# EAGLE design RQ2_mainboard (EAGLE 7.7.0)
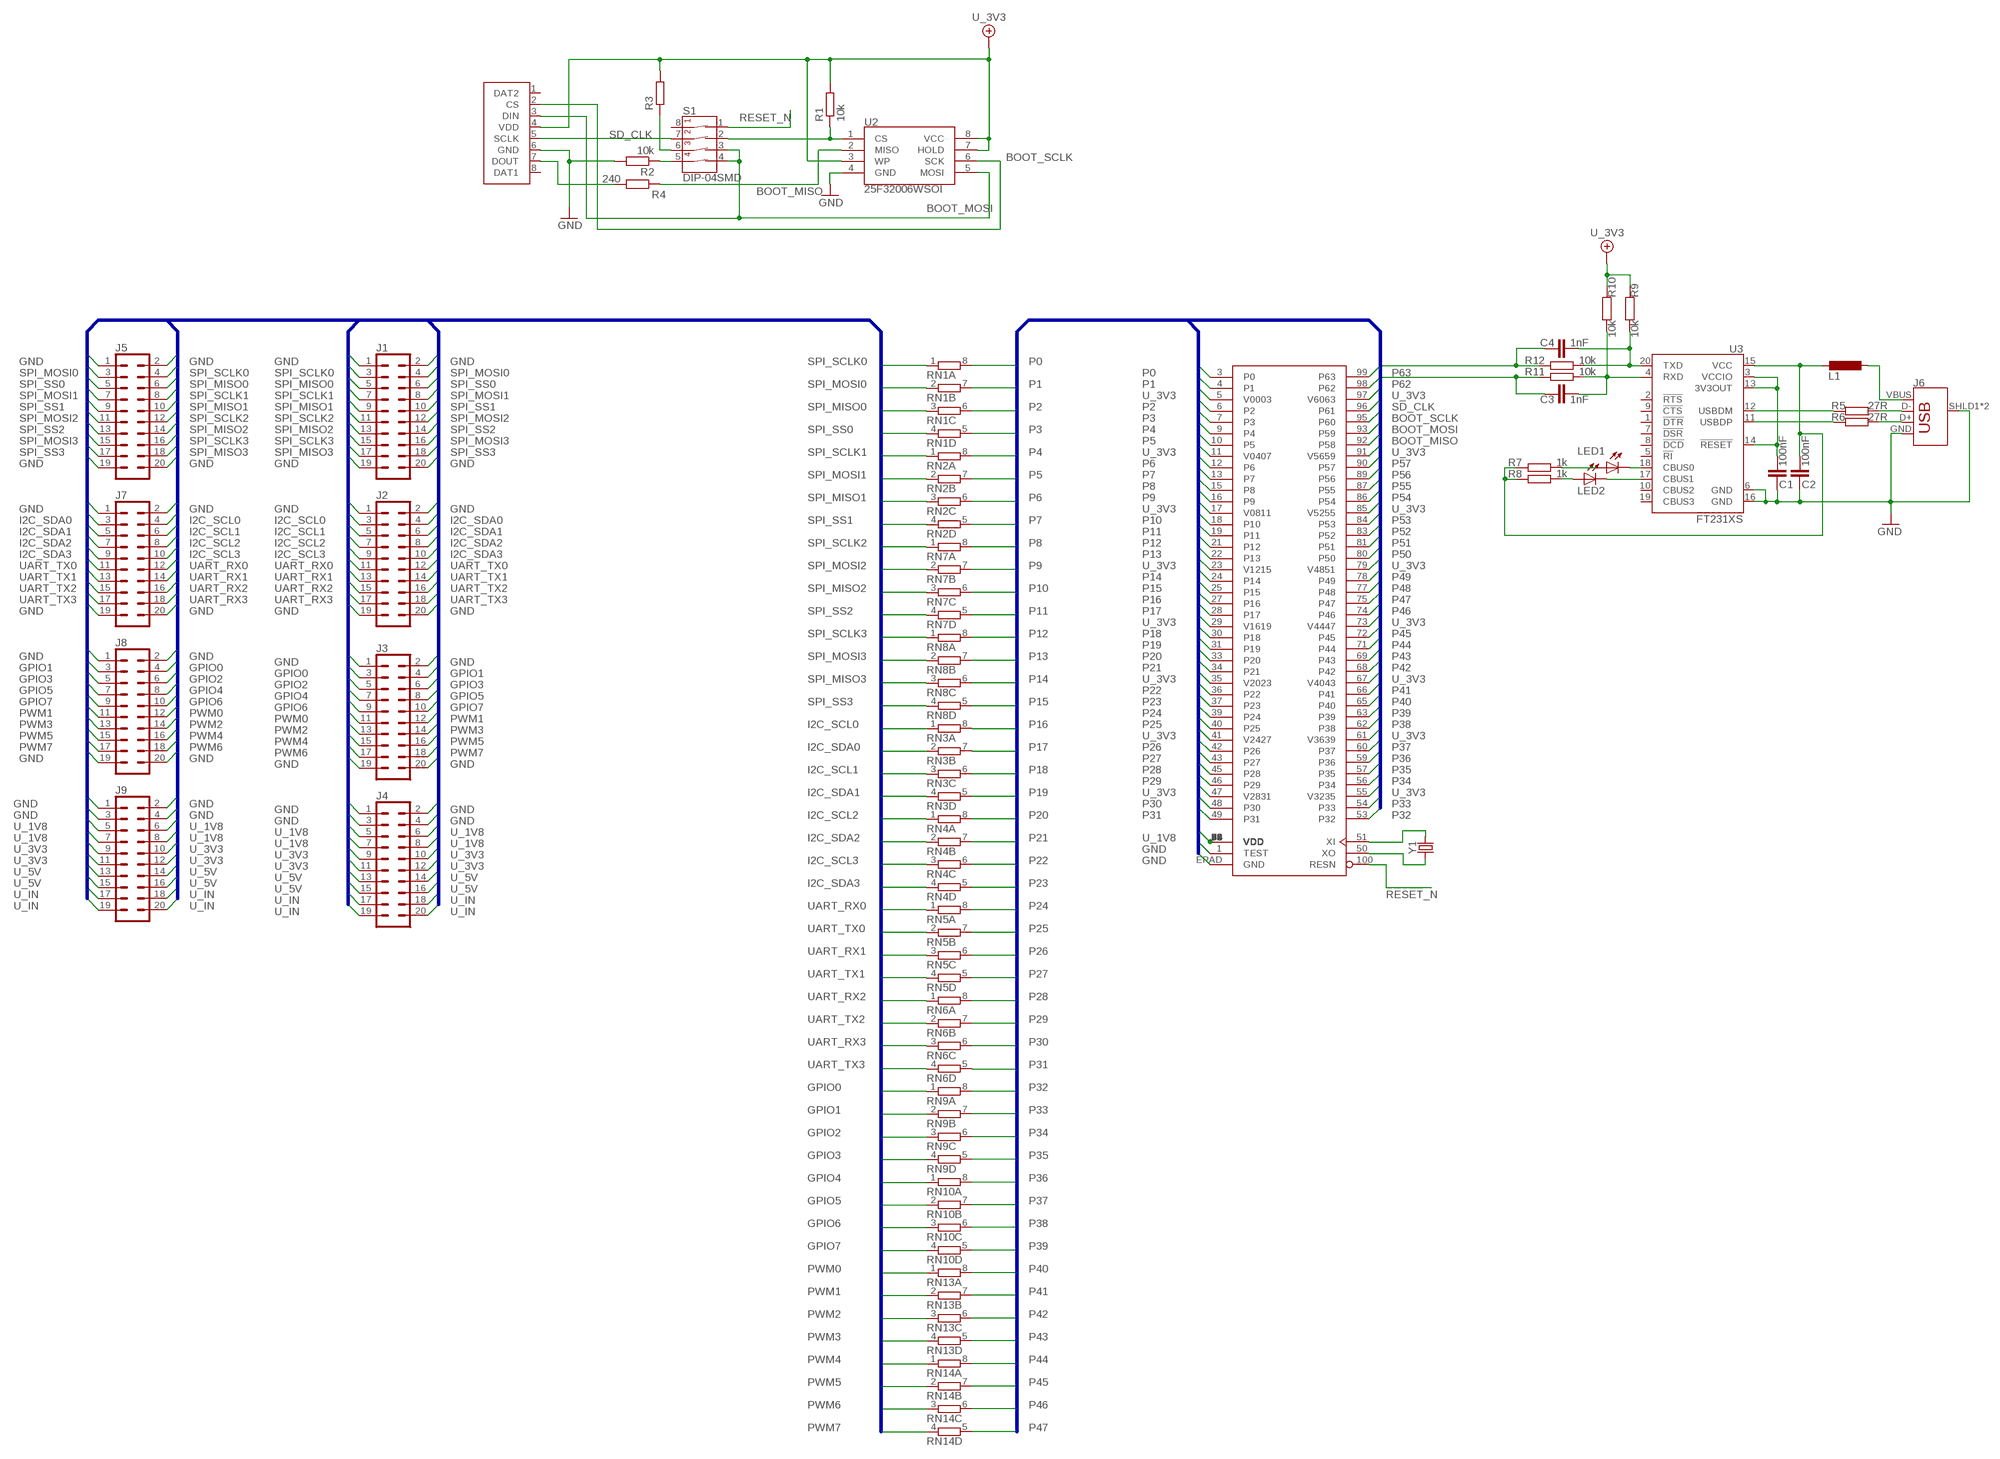
[diagram p0: schematic, sheet 1]

## Parts
C1  100nF  C-EUC0805  [C0805]
C2  100nF  C-EUC0805  [C0805]
C3  1nF  C-EUC0805  [C0805]
C4  1nF  C-EUC0805  [C0805]
J1  CONN_10X2SMT  [2X10_SMT]
J2  CONN_10X2SMT  [2X10_SMT]
J3  CONN_10X2SMT  [2X10_SMT]
J4  CONN_10X2SMT  [2X10_SMT]
J5  CONN_10X2SMT  [2X10_SMT]
J6  USB_B_PTH  [USB-B-PTH]
J7  CONN_10X2SMT  [2X10_SMT]
J8  CONN_10X2SMT  [2X10_SMT]
J9  CONN_10X2SMT  [2X10_SMT]
L1  L-EUL2012C  [L2012C]
LED1  LEDSML0805  [SML0805]
LED2  LEDSML0805  [SML0805]
R1  10k  R-EU_R0603  [R0603]
R2  10k  R-EU_R0603  [R0603]
R3  R-EU_R0603  [R0603]
R4  240  R-EU_R0603  [R0603]
R5  27R  R-EU_R0603  [R0603]
R6  27R  R-EU_R0603  [R0603]
R7  1k  R-EU_R0603  [R0603]
R8  1k  R-EU_R0603  [R0603]
R9  10k  R-EU_R0603  [R0603]
R10  10k  R-EU_R0603  [R0603]
R11  10k  R-EU_R0603  [R0603]
R12  10k  R-EU_R0603  [R0603]
RN1  4R-N0603-ARV  [0603-ARV]
RN2  4R-N0603-ARV  [0603-ARV]
RN3  4R-N0603-ARV  [0603-ARV]
RN4  4R-N0603-ARV  [0603-ARV]
RN5  4R-N0603-ARV  [0603-ARV]
RN6  4R-N0603-ARV  [0603-ARV]
RN7  4R-N0603-ARV  [0603-ARV]
RN8  4R-N0603-ARV  [0603-ARV]
RN9  4R-N0603-ARV  [0603-ARV]
RN10  4R-N0603-ARV  [0603-ARV]
RN13  4R-N0603-ARV  [0603-ARV]
RN14  4R-N0603-ARV  [0603-ARV]
S1  DIP-04SMD  [DIPSWITCH-04-SMD]
U1  P2X8C4M64P  [TQFP100]
U2  25F32006WSOI  SPI_FLASH-X25XXSMD1  [SO08-EIAJ]
U3  FT231XS  [SSOP20_L]
U$2  MICRO_SD_CONNECTORMOLEX_HINGE  [MICRO_SD]
Y1  CRYSTALSMD-5X3.2-2PAD  [CRYSTAL-SMD-5X3.2-2PAD]

## Nets
BOOT_MISO: R4.1 U1.92(P58) U2.2(MISO)
BOOT_MOSI: S1.3(3A) S1.4(4A) U1.93(P59) U2.5(MOSI) U$2.3(DIN)
BOOT_SCLK: U1.95(P60) U2.6(SCK) U$2.2(CS)
CBUS0: LED1.C U3.18(CBUS0)
CBUS1: LED2.C U3.17(CBUS1)
D_M: J6.D- R5.2
D_P: J6.D+ R6.2
FLASH_CS: R1.1 S1.2(2A) U2.1(CS)
GND: C1.2 C2.2 J1.1 J1.2 J1.19 J1.20 J2.1 J2.2 J2.19 J2.20 J3.1 J3.2 J3.19 J3.20 J4.1 J4.2 J4.3 J4.4 J5.1 J5.2 J5.19 J5.20 J6.GND J6.SHLD1(SHIELD) J6.SHLD2(SHIELD) J7.1 J7.2 J7.19 J7.20 J8.1 J8.2 J8.19 J8.20 J9.1 J9.2 J9.3 J9.4 R2.2 U1.1(TEST) U1.EPAD(GND) U2.4(GND) U3.6(GND) U3.16(GND) U$2.6(GND)
GPIO0: J3.3 J8.4 RN9.1
GPIO1: J3.4 J8.3 RN9.2
GPIO2: J3.5 J8.6 RN9.3
GPIO3: J3.6 J8.5 RN9.4
GPIO4: J3.7 J8.8 RN10.1
GPIO5: J3.8 J8.7 RN10.2
GPIO6: J3.9 J8.10 RN10.3
GPIO7: J3.10 J8.9 RN10.4
I2C_SCL0: J2.3 J7.4 RN3.1
I2C_SCL1: J2.5 J7.6 RN3.3
I2C_SCL2: J2.7 J7.8 RN4.1
I2C_SCL3: J2.9 J7.10 RN4.3
I2C_SDA0: J2.4 J7.3 RN3.2
I2C_SDA1: J2.6 J7.5 RN3.4
I2C_SDA2: J2.8 J7.7 RN4.2
I2C_SDA3: J2.10 J7.9 RN4.4
LED1: LED1.A R7.2
LED2: LED2.A R8.2
N$7: R2.1 S1.5(4B)
N$8: R3.1 S1.6(3B)
N$10: R4.2 U$2.7(DOUT)
P0: RN1.8 U1.3(P0)
P1: RN1.7 U1.4(P1)
P2: RN1.6 U1.6(P2)
P3: RN1.5 U1.7(P3)
P4: RN2.8 U1.9(P4)
P5: RN2.7 U1.10(P5)
P6: RN2.6 U1.12(P6)
P7: RN2.5 U1.13(P7)
P8: RN7.8 U1.15(P8)
P9: RN7.7 U1.16(P9)
P10: RN7.6 U1.18(P10)
P11: RN7.5 U1.19(P11)
P12: RN8.8 U1.21(P12)
P13: RN8.7 U1.22(P13)
P14: RN8.6 U1.24(P14)
P15: RN8.5 U1.25(P15)
P16: RN3.8 U1.27(P16)
P17: RN3.7 U1.28(P17)
P18: RN3.6 U1.30(P18)
P19: RN3.5 U1.31(P19)
P20: RN4.8 U1.33(P20)
P21: RN4.7 U1.34(P21)
P22: RN4.6 U1.36(P22)
P23: RN4.5 U1.37(P23)
P24: RN5.8 U1.39(P24)
P25: RN5.7 U1.40(P25)
P26: RN5.6 U1.42(P26)
P27: RN5.5 U1.43(P27)
P28: RN6.8 U1.45(P28)
P29: RN6.7 U1.46(P29)
P30: RN6.6 U1.48(P30)
P31: RN6.5 U1.49(P31)
P32: RN9.8 U1.53(P32)
P33: RN9.7 U1.54(P33)
P34: RN9.6 U1.56(P34)
P35: RN9.5 U1.57(P35)
P36: RN10.8 U1.59(P36)
P37: RN10.7 U1.60(P37)
P38: RN10.6 U1.62(P38)
P39: RN10.5 U1.63(P39)
P40: RN13.8 U1.65(P40)
P41: RN13.7 U1.66(P41)
P42: RN13.6 U1.68(P42)
P43: RN13.5 U1.69(P43)
P44: RN14.8 U1.71(P44)
P45: RN14.7 U1.72(P45)
P46: RN14.6 U1.74(P46)
P47: RN14.5 U1.75(P47)
P48: U1.77(P48)
P49: U1.78(P49)
P50: U1.80(P50)
P51: U1.81(P51)
P52: U1.83(P52)
P53: U1.84(P53)
P54: U1.86(P54)
P55: U1.87(P55)
P56: U1.89(P56)
P57: U1.90(P57)
P62: C3.1 R11.1 U1.98(P62)
P63: C4.1 R12.1 U1.99(P63)
PWM0: J3.11 J8.12 RN13.1
PWM1: J3.12 J8.11 RN13.2
PWM2: J3.13 J8.14 RN13.3
PWM3: J3.14 J8.13 RN13.4
PWM4: J3.15 J8.16 RN14.1
PWM5: J3.16 J8.15 RN14.2
PWM6: J3.17 J8.18 RN14.3
PWM7: J3.18 J8.17 RN14.4
RESET_N: S1.1(1A) U1.100(RESN)
SD_CLK: S1.7(2B) U1.96(P61) U$2.5(SCLK)
SPI_MISO0: J1.5 J5.6 RN1.3
SPI_MISO1: J1.9 J5.10 RN2.3
SPI_MISO2: J1.13 J5.14 RN7.3
SPI_MISO3: J1.17 J5.18 RN8.3
SPI_MOSI0: J1.4 J5.3 RN1.2
SPI_MOSI1: J1.8 J5.7 RN2.2
SPI_MOSI2: J1.12 J5.11 RN7.2
SPI_MOSI3: J1.16 J5.15 RN8.2
SPI_SCLK0: J1.3 J5.4 RN1.1
SPI_SCLK1: J1.7 J5.8 RN2.1
SPI_SCLK2: J1.11 J5.12 RN7.1
SPI_SCLK3: J1.15 J5.16 RN8.1
SPI_SS0: J1.6 J5.5 RN1.4
SPI_SS1: J1.10 J5.9 RN2.4
SPI_SS2: J1.14 J5.13 RN7.4
SPI_SS3: J1.18 J5.17 RN8.4
U_1V8: J4.5 J4.6 J4.7 J4.8 J9.5 J9.6 J9.7 J9.8 U1.2(VDD) U1.8(VDD) U1.14(VDD) U1.20(VDD) U1.26(VDD) U1.32(VDD) U1.38(VDD) U1.44(VDD) U1.52(VDD) U1.58(VDD) U1.64(VDD) U1.70(VDD) U1.76(VDD) U1.82(VDD) U1.88(VDD) U1.94(VDD)
U_3V3: J4.9 J4.10 J4.11 J4.12 J9.9 J9.10 J9.11 J9.12 R1.2 R3.2 R9.1 R10.1 U1.5(V0003) U1.11(V0407) U1.17(V0811) U1.23(V1215) U1.29(V1619) U1.35(V2023) U1.41(V2427) U1.47(V2831) U1.55(V3235) U1.61(V3639) U1.67(V4043) U1.73(V4447) U1.79(V4851) U1.85(V5255) U1.91(V5659) U1.97(V6063) U2.3(WP) U2.7(HOLD) U2.8(VCC) U$2.4(VDD)
U_5V: J4.13 J4.14 J4.15 J4.16 J9.13 J9.14 J9.15 J9.16
U_IN: J4.17 J4.18 J4.19 J4.20 J9.17 J9.18 J9.19 J9.20
UART_RX0: J2.11 J7.12 RN5.1
UART_RX1: J2.13 J7.14 RN5.3
UART_RX2: J2.15 J7.16 RN6.1
UART_RX3: J2.17 J7.18 RN6.3
UART_TX0: J2.12 J7.11 RN5.2
UART_TX1: J2.14 J7.13 RN5.4
UART_TX2: J2.16 J7.15 RN6.2
UART_TX3: J2.18 J7.17 RN6.4
USB_3V3: C1.1 U3.3(VCCIO) U3.13(3V3OUT) U3.14(!RESET)
USB_5V: C2.1 L1.2 R7.1 R8.1 U3.15(VCC)
USB_RX: C3.2 R10.2 R11.2 U3.4(RXD)
USB_TX: C4.2 R9.2 R12.2 U3.20(TXD)
USBDM: R5.1 U3.12(USBDM)
USBDP: R6.1 U3.11(USBDP)
VBUS: J6.VBUS L1.1
XIN: U1.51(XI) Y1.P$2
XOUT: U1.50(XO) Y1.P$1
Unconnected: S1.8(1B) U3.1(!DTR) U3.2(!RTS) U3.5(!RI) U3.7(!DSR) U3.8(!DCD) U3.9(!CTS) U3.10(CBUS2) U3.19(CBUS3) U$2.1(DAT2) U$2.8(DAT1)

## Buses
P[0..63],SPI_SCLK[0..3],SPI_MOSI[0..3],SPI_MISO[0..3],SPI_SS[0..3],I2C_SCL[0..3],I2C_SDA[0..3],SD0_CLK,SD0_CMD,SD0_DAT[0..3],SD1_CLK,SD1_CMD,SD1_DAT[0..3],GPIO[0..15],PWM[0..7],UART_RX[0..3],UART_TX[0..3],BOOT_SCLK,BOOT_MISO,BOOT_MOSI,SD_CLK,RESET_N,XIN,XOUT,U_1V8,U_3V3,U_5V,U_IN,GND
R_SPI_SCLK[0..3],R_SPI_MOSI[0..3],R_SPI_MISO[0..3],R_SPI_SS[0..3],R_I2C_SCL[0..3],R_I2C_SDA[0..3],SD0_CLK,SD0_CMD,SD0_DAT[0..3],SD1_CLK,SD1_CMD,SD1_DAT[0..3],R_GPIO[0..7],R_ADC[0..7],R_PWM[0..7],R_UART_RX[0..3],R_UART_TX[0..3],RESET_N,XIN,XOUT,U_1V8,U_3V3,U_5V,U_IN,GND
SPI_SCLK[0..3],SPI_MOSI[0..3],SPI_MISO[0..3],SPI_SS[0..3],I2C_SCL[0..3],I2C_SDA[0..3],SD0_CLK,SD0_CMD,SD0_DAT[0..3],SD1_CLK,SD1_CMD,SD1_DAT[0..3],GPIO[0..7],R_ADC[0..7],PWM[0..7],UART_RX[0..3],UART_TX[0..3],RESET_N,XIN,XOUT,U_1V8,U_3V3,U_5V,U_IN,GND

## Library data of the parts
C1-C4 = rcl:C-EU: CAPACITOR, European symbol
J1-J5 J7-J9 = SparkFun-Connectors:CONN_10X2: Multi connection point. Often used as Generic Header-pin footprint for 0.1 inch spaced/style header connections On any of the 0.1 inch spaced packages, you can populate with these: Break Away Headers - Straight (PRT-00116) Break Away Male Headers - Right Angle (PRT-00553) Female Headers (PRT-00115) Break Away Headers - Machine Pin (PRT-00117) Break Away Female Headers - Swiss Machine Pin (PRT-00743) Special note about the "SPECIAL" package: This was SPECIALLY designed to be used with our Graphic LCD Backpack. Be sure you want to use this! It is not only staggered on each line of header holes, but IT IS ALSO offset of the center point of the top and bottom lines by 5 mil. This causes the headers to lock into place on the "standard" footprint on the LCD screen. The extra squares on the tdocu layer are there simply to reference other pins (if you were to actually populate a longer header than ten long - this is what we do with the backpacks).
J6 = SparkFun-Connectors:USB_B: USB Type B Connector SparkFun Products: SparkFun Stepoko <https://www.sparkfun.com/products/13899> PTH; PROD_ID: CONN-08278; SF_ID: PRT-00139
L1 = rcl:L-EU: INDUCTOR, European symbol
LED1 LED2 = led:LED: LED OSRAM: - CHIPLED LG R971, LG N971, LY N971, LG Q971, LY Q971, LO R971, LY R971 LH N974, LH R974 LS Q976, LO Q976, LY Q976 LO Q996 - Hyper CHIPLED LW Q18S LB Q993, LB Q99A, LB R99A - SideLED LS A670, LO A670, LY A670, LG A670, LP A670 LB A673, LV A673, LT A673, LW A673 LH A674 LY A675 LS A676, LA A676, LO A676, LY A676, LW A676 LS A679, LY A679, LG A679 - Hyper Micro SIDELED® LS Y876, LA Y876, LO Y876, LY Y876 LT Y87S - SmartLED LW L88C, LW L88S LB L89C, LB L89S, LG L890 LS L89K, LO L89K, LY L89K LS L896, LA L896, LO L896, LY L896 - TOPLED LS T670, LO T670, LY T670, LG T670, LP T670 LSG T670, LSP T670, LSY T670, LOP T670, LYG T670 LG T671, LOG T671, LSG T671 LB T673, LV T673, LT T673, LW T673 LH T674 LS T676, LA T676, LO T676, LY T676, LB T676, LH T676, LSB T676, LW T676 LB T67C, LV T67C, LT T67C, LS T67K, LO T67K, LY T67K, LW E67C LS E67B, LA E67B, LO E67B, LY E67B, LB E67C, LV E67C, LT E67C LW T67C LS T679, LY T679, LG T679 LS T770, LO T770, LY T770, LG T770, LP T770 LB T773, LV T773, LT T773, LW T773 LH T774 LS E675, LA E675, LY E675, LS T675 LS T776, LA T776, LO T776, LY T776, LB T776 LHGB T686 LT T68C, LB T68C - Hyper Mini TOPLED® LB M676 - Mini TOPLED Santana® LG M470 LS M47K, LO M47K, LY M47K Source: http://www.osram.convergy.de LUXEON: - LUMILED® LXK2-PW12-R00, LXK2-PW12-S00, LXK2-PW14-U00, LXK2-PW14-V00 LXK2-PM12-R00, LXK2-PM12-S00, LXK2-PM14-U00 LXK2-PE12-Q00, LXK2-PE12-R00, LXK2-PE12-S00, LXK2-PE14-T00, LXK2-PE14-U00 LXK2-PB12-K00, LXK2-PB12-L00, LXK2-PB12-M00, LXK2-PB14-N00, LXK2-PB14-P00, LXK2-PB14-Q00 LXK2-PR12-L00, LXK2-PR12-M00, LXK2-PR14-Q00, LXK2-PR14-R00 LXK2-PD12-Q00, LXK2-PD12-R00, LXK2-PD12-S00 LXK2-PH12-R00, LXK2-PH12-S00 LXK2-PL12-P00, LXK2-PL12-Q00, LXK2-PL12-R00 Source: www.luxeon.com KINGBRIGHT: KA-3528ASYC Source: www.kingbright.com
R1-R12 = rcl:R-EU_: RESISTOR, European symbol
RN1-RN10 RN13 RN14 = resistor-dil:4R-N: Array Chip Resistor Source: RS Component / Phycomp; OC_FARNELL: unknown; OC_NEWARK: unknown
S1 = SparkFun-Switches:DIP-04: 4-Position DIP Switch 4-circuit DIP (dual inline package) switch. Commonly used to physcially set a circuit's behavior. SparkFun Products Prototype Part; PROD_ID: SWCH-12418
U1 = parallax:P2X8C4M64P
U2 = SparkFun-IC-Memory:SPI_FLASH-X25XX: 32M Serial Flash Memory 8pin SPI Flash series x25xx. Works with devices like W25X32 and BR25L32 Datasheet SparkFun Products SparkFun Venus GPS Logger (GPS-10920); PROD_ID: IC-09109
U3 = SparkFun-IC-Comms:FT231X: FTDI FT231X Full Speed USB to Full-handshake UART This USB2.0 Full Speed IC offers a compact bridge to full handshake UART interfaces. The device is a UART, capable of operating up to 3MBaud, with low power consumption (8mA). The FT231X includes the complete FT-X series feature set and enables USB to be added into a system design quickly and easily over a UART interface. Datasheet SparkFun Products SparkFun RedBoard - Programmed with Arduino (DEV-12757) SparkFun XBee Explorer USB (WRL-11812) SparkFun XBee Explorer Dongle (WRL-11697) SparkFun Blynk Board - ESP8266 (WRL-13794) SparkFun ESP8266 Thing - Dev Board (WRL-13711) SparkFun Block for Intel® Edison - Base (DEV-13045) SparkFun RedStick (DEV-13741) SparkFun Beefy 3 - FTDI Basic Breakout (DEV-13746) SparkFun FT231X Breakout (BOB-11736); PROD_ID: IC-11524
U$2 = connector:MICRO_SD_CONNECTOR
Y1 = SparkFun-Clocks:CRYSTAL: Crystals (Generic) These are passive quartz crystals, which can be used as a clock source for a microcontroller. Crystal's are two-terminal devices. They require external "load" capacitors to generate an oscillating signal.

## Board
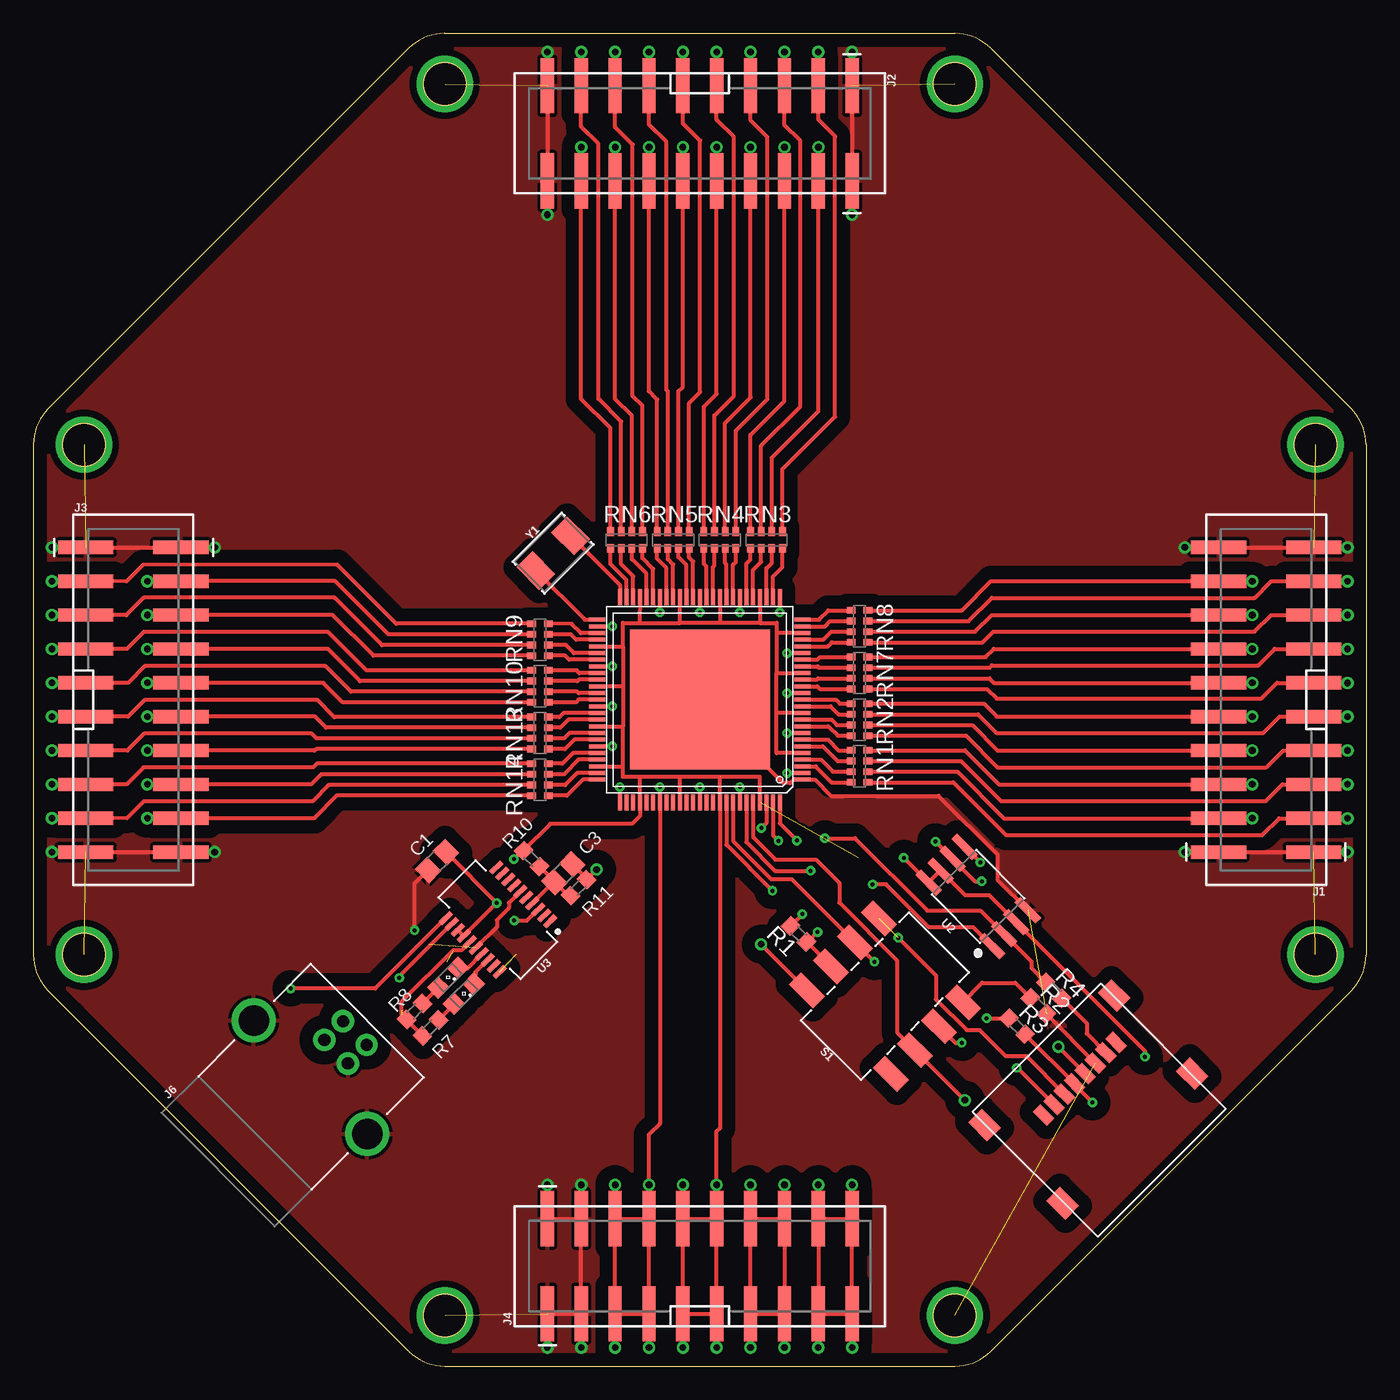
[diagram p1: board, top side]
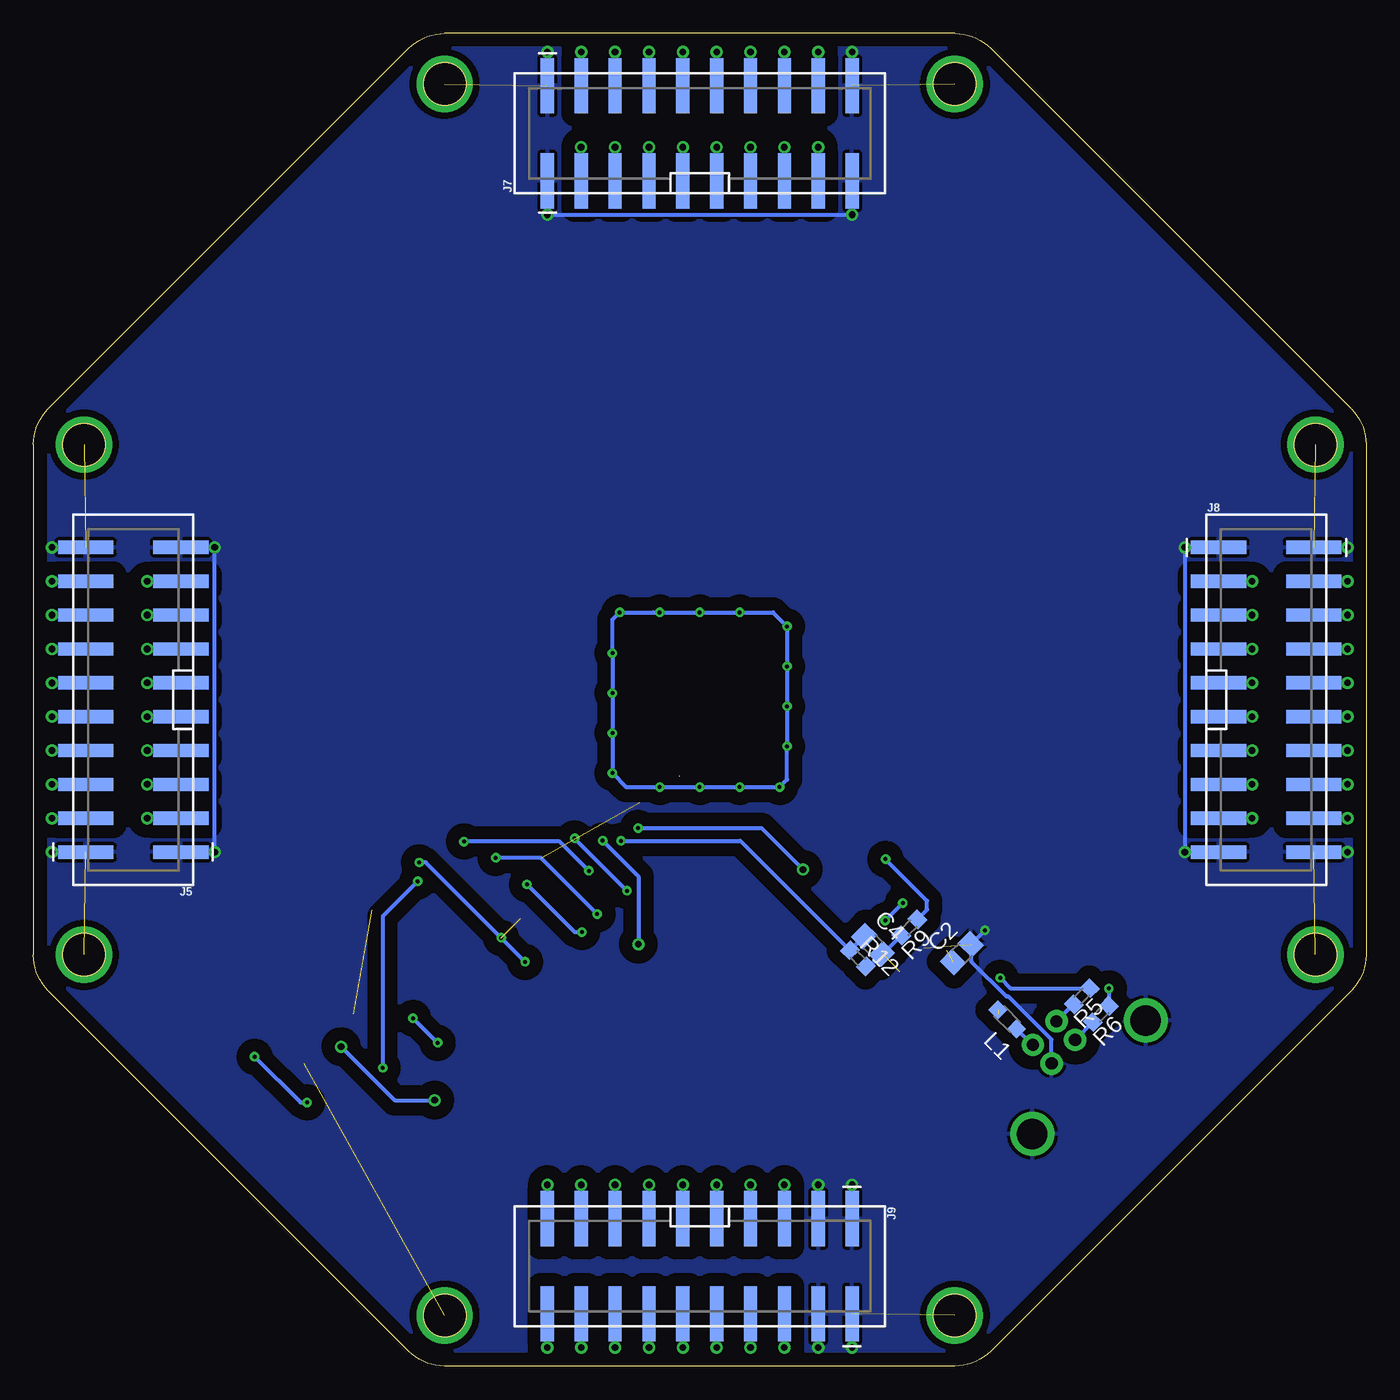
[diagram p2: board, bottom side, seen from below]

Size 100 x 100 mm. Coordinates in mm from the lower left corner, seen from the top.
Outline: 100,70.71 100,70.71
Outline: 29.29,100 29.29,100
Outline: 70.71,100 70.71,100
Outline: 70.71,0 70.71,0
Outline: 70.71,100 70.71,100
Outline: 100,70.71 100,70.71
Outline: 0,70.71 0,70.71
Outline: 26.36,97.07 26.36,97.07
Outline: 2.93,73.64 2.93,73.64
Outline: 29.29,100 29.29,100
Outline: 29.29,0 29.29,0
Outline: 2.93,26.36 2.93,26.36
Outline: 0,29.29 0,29.29
Outline: 0,70.71 0,70.71
Outline: 26.36,2.93 26.36,2.93
Outline: 0,29.29 0,29.29
Outline: 70.71,0 70.71,0
Outline: 29.29,0 29.29,0
Outline: 1.12,71.83 arc45 0,69.14 0,30.87 arc45 1.12,28.17 28.18,1.12 arc45 30.87,0 69.14,0 arc45 71.83,1.12 98.89,28.17 arc45 100,30.87 100,69.13 arc45 98.89,71.83 71.83,98.89 arc45 69.13,100 30.87,100 arc45 28.18,98.89 1.12,71.83
Outline: circle at 3.81,69.14 radius 1.6
Outline: circle at 3.81,30.87 radius 1.6
Outline: circle at 30.87,3.81 radius 1.6
Outline: circle at 69.14,3.81 radius 1.6
Outline: circle at 96.19,30.87 radius 1.6
Outline: circle at 96.19,69.13 radius 1.6
Outline: circle at 69.13,96.19 radius 1.6
Outline: circle at 30.87,96.19 radius 1.6
Copper layers (1*16): Top 0.035mm / dielectric 1.5mm / Bottom 0.035mm
Design rules "default": minimum track width 10mil, minimum drill 24mil, track to track 8mil, track to pad 8mil, pad to pad 8mil, via to via 8mil, smd to smd 8mil, copper to edge 40mil, drill to drill 8mil, minimum pad ring 10mil, minimum via ring 8mil, stop-mask expansion 4mil, vias tented up to drill 0mil, thermal gap 10mil

### Footprints (pad centres in the part's own frame; a part is rotated, then mirrored left to right if it is on the bottom)
C0805 = smd 1.3 x 1.5: 1 -0.95,0; 2 0.95,0
2X10_SMT = smd 4.14 x 0.991: 1 -3.569,11.43; 2 3.569,11.43; 3 -3.569,8.89; 4 3.569,8.89; 5 -3.569,6.35; 6 3.569,6.35; 7 -3.569,3.81; 8 3.569,3.81; 9 -3.569,1.27; 10 3.569,1.27; 11 -3.569,-1.27; 12 3.569,-1.27; 13 -3.569,-3.81; 14 3.569,-3.81; 15 -3.569,-6.35; 16 3.569,-6.35; 17 -3.569,-8.89; 18 3.569,-8.89; 19 -3.569,-11.43; 20 3.569,-11.43
USB-B-PTH = drill 0.914 pad 1.676: D+ 4,1.25; D- 5.981,1.25; GND 4,-1.25; VBUS 5.981,-1.25 | drill 2.286: SHLD1 1.282,-6.02; SHLD2 1.282,6.02
L2012C = smd 1 x 1: 1 -1,0; 2 1,0
SML0805 = smd 1.2 x 1.2: A 1.05,0; C -1.05,0
R0603 = smd 1 x 1.1: 1 -0.85,0; 2 0.85,0
0603-ARV = smd 0.5 x 0.65: 1 -1.2,-0.625; 2 -0.4,-0.625; 3 0.4,-0.625; 4 1.2,-0.625; 5 1.2,0.625; 6 0.4,0.625; 7 -0.4,0.625; 8 -1.2,0.625
DIPSWITCH-04-SMD = smd 1.27 x 2.54: 1 -3.81,4.445; 2 -1.27,4.445; 3 1.27,4.445; 4 3.81,4.445; 5 3.81,-4.445; 6 1.27,-4.445; 7 -1.27,-4.445; 8 -3.81,-4.445
TQFP100 = smd 1.2 x 0.3: 1 -7.7,6; 2 -7.7,5.5; 3 -7.7,5; 4 -7.7,4.5; 5 -7.7,4; 6 -7.7,3.5; 7 -7.7,3; 8 -7.7,2.5; 9 -7.7,2; 10 -7.7,1.5; 11 -7.7,1; 12 -7.7,0.5; 13 -7.7,0; 14 -7.7,-0.5; 15 -7.7,-1; 16 -7.7,-1.5; 17 -7.7,-2; 18 -7.7,-2.5; 19 -7.7,-3; 20 -7.7,-3.5; 21 -7.7,-4; 22 -7.7,-4.5; 23 -7.7,-5; 24 -7.7,-5.5; 25 -7.7,-6; 51 7.7,-6; 52 7.7,-5.5; 53 7.7,-5; 54 7.7,-4.5; 55 7.7,-4; 56 7.7,-3.5; 57 7.7,-3; 58 7.7,-2.5; 59 7.7,-2; 60 7.7,-1.5; 61 7.7,-1; 62 7.7,-0.5; 63 7.7,0; 64 7.7,0.5; 65 7.7,1; 66 7.7,1.5; 67 7.7,2; 68 7.7,2.5; 69 7.7,3; 70 7.7,3.5; 71 7.7,4; 72 7.7,4.5; 73 7.7,5; 74 7.7,5.5; 75 7.7,6 | smd 0.3 x 1.2: 26 -6,-7.7; 27 -5.5,-7.7; 28 -5,-7.7; 29 -4.5,-7.7; 30 -4,-7.7; 31 -3.5,-7.7; 32 -3,-7.7; 33 -2.5,-7.7; 34 -2,-7.7; 35 -1.5,-7.7; 36 -1,-7.7; 37 -0.5,-7.7; 38 0,-7.7; 39 0.5,-7.7; 40 1,-7.7; 41 1.5,-7.7; 42 2,-7.7; 43 2.5,-7.7; 44 3,-7.7; 45 3.5,-7.7; 46 4,-7.7; 47 4.5,-7.7; 48 5,-7.7; 49 5.5,-7.7; 50 6,-7.7; 76 6,7.7; 77 5.5,7.7; 78 5,7.7; 79 4.5,7.7; 80 4,7.7; 81 3.5,7.7; 82 3,7.7; 83 2.5,7.7; 84 2,7.7; 85 1.5,7.7; 86 1,7.7; 87 0.5,7.7; 88 0,7.7; 89 -0.5,7.7; 90 -1,7.7; 91 -1.5,7.7; 92 -2,7.7; 93 -2.5,7.7; 94 -3,7.7; 95 -3.5,7.7; 96 -4,7.7; 97 -4.5,7.7; 98 -5,7.7; 99 -5.5,7.7; 100 -6,7.7 | smd 10.5 x 10.5: EPAD 0,0
SO08-EIAJ = smd 0.61 x 2.21: 1 -1.905,-3.378; 2 -0.635,-3.378; 3 0.635,-3.378; 4 1.905,-3.378; 5 1.905,3.353; 6 0.635,3.353; 7 -0.635,3.353; 8 -1.905,3.353
SSOP20_L = smd 0.381 x 1.143: 1 -2.857,-2.68; 2 -2.223,-2.68; 3 -1.587,-2.68; 4 -0.953,-2.68; 5 -0.318,-2.68; 6 0.318,-2.68; 7 0.953,-2.68; 8 1.587,-2.68; 9 2.223,-2.68; 10 2.857,-2.68; 11 2.857,2.68; 12 2.223,2.68; 13 1.587,2.68; 14 0.953,2.68; 15 0.318,2.68; 16 -0.318,2.68; 17 -0.953,2.68; 18 -1.587,2.68; 19 -2.223,2.68; 20 -2.857,2.68
MICRO_SD = smd 0.8 x 1.5: 1 3.6,9.35; 2 4.7,9.35; 3 5.8,9.35; 4 6.9,9.35; 5 8,9.35; 6 9.1,9.35; 7 10.2,9.35; 8 11.3,9.35 | smd 1.45 x 2: SHLD0 13.675,3.65; SHLD1 13.675,11.95; SHLD2 -0.075,11.95; SHLD3 -0.075,3.65
CRYSTAL-SMD-5X3.2-2PAD = smd 1.7 x 2.4: P$1 1.85,0; P$2 -1.85,0

### Placement (x,y rotation side)
C1  30.29,37.9 225 top
C2  30.34,30.99 45 bottom
C3  39.76,36.99 225 top
C4  37,31.61 315 bottom
J1  92.5,50 180 top
J2  50,92.5 270 top
J3  7.5,50 0 top
J4  50,7.5 90 top
J5  92.5,50 180 bottom
J6  19.89,20.77 45 top
J7  50,92.5 90 bottom
J8  7.5,50 0 bottom
J9  50,7.5 270 bottom
L1  26.94,26.03 135 bottom
LED1  32.3,27.94 225 top
LED2  31.12,29.15 225 top
R1  57.42,32.43 135 top
R2  75.41,27.03 315 top
R3  73.81,25.51 315 top
R4  76.55,28.21 315 top
R5  21.34,27.76 225 bottom
R6  19.9,26.42 225 bottom
R7  29.8,25.39 45 top
R8  28.61,26.63 45 top
R9  34.28,32.91 225 bottom
R10  37.39,38.08 315 top
R11  40.9,35.91 225 top
R12  38.14,30.61 315 bottom
RN1  62,45 90 top
RN2  62,48.5 90 top
RN3  55,62 180 top
RN4  51.5,62 180 top
RN5  48,62 180 top
RN6  44.5,62 180 top
RN7  62,52 90 top
RN8  62,55.5 90 top
RN9  38,54.5 270 top
RN10  38,51 270 top
RN13  38,47.5 270 top
RN14  38,44 270 top
S1  63.9,27.76 45 top
U1  50,50 180 top
U2  70.89,35.26 45 top
U3  34.87,33.5 135 top
U$2  79.87,9.69 45 top
Y1  39,61 45 top

### Tracks (layer width: path | path; a pad name or v marks a point on that pad's centre or on a via)
BOOT_MISO  (via drill 0.3)
  Top 0.3: U1.92 52,39.13 v55.46,35.67 | v59.39,39.61 61.66,39.61 67.08,34.19 71.05,34.19 U2.2 74.89,30.35 74.89,29.87 R4.1
  Bottom 0.3: v55.46,35.67 v59.39,39.61
BOOT_MOSI  (via drill 0.3)  (1 unrouted)
  Top 0.3: S1.3 | U$2.3 74.49,23.27 72.95,23.27 71,25.22 70.03,25.22 67.72,27.53 67.72,29.32 v64.9,32.14 | U1.93 52.5,39.41 55.36,36.56 56.89,36.56 S1.3 | S1.3 v63.11,30.34 | v71.05,37.8 U2.5
  Bottom 0.3: v63.11,30.34 v64.9,32.14 70.56,37.8 v71.05,37.8
BOOT_SCLK  (via drill 0.3)
  Top 0.3: U1.95 53.5,39.32 55.65,37.17 v58.32,37.17 | 67.7,39.34 v67.7,39.37 68.96,38.1 U2.6 70.65,36.39 v71.16,36.39 | v73.79,22.38 73.82,22.38 U$2.2
  Bottom 0.3: v71.16,36.39 73.79,33.76 v73.79,22.38 | v58.32,37.17 60.52,39.37 v67.7,39.37
CBUS0
  Top 0.3: U3.18 33.18,29.57 33.18,29.37 33.04,29.23 LED1.C
CBUS1
  Top 0.3: U3.17 32.53,29.82 LED2.C
D_M
  Bottom 0.3: R5.2 21.96,27.15 J6.D-
D_P
  Bottom 0.3: R6.2 J6.D+
FLASH_CS  (via drill 0.3)
  Top 0.3: S1.2 R1.1 58.1,31.83 v58.85,32.57 | U2.1 70.53,32.92 67.2,32.92 63.97,36.15 v62.97,36.15
  Bottom 0.3: v62.97,36.15 59.39,32.57 v58.85,32.57
GND  (via drill 0.3, 0.5, 3.2)  (10 unrouted)
  Top 0.3: v38.57,86.4 J7.19 J7.20 v38.57,98.6 | v61.43,98.6 J7.2 J7.1 v61.43,86.4 | v86.4,38.57 J5.1 J5.2 v98.6,38.57 | v13.6,38.57 J8.19 J8.20 v1.4,38.57 | v86.4,61.43 J5.19 J5.20 v98.6,61.43 | v1.4,61.43 J8.2 J8.1 v13.6,61.43 | U1.EPAD 55.02,44.98 56.25,43.75 56.8,43.75 57.05,44 U1.1 58.63,44 59.84,42.79 67.93,42.79 72.34,38.38 72.34,36.5 U2.4 | J9.4 v41.11,1.4 | v38.57,1.4 J9.2 J9.4 | v41.11,13.6 J9.3 | J9.3 J9.1 v38.57,13.6 | J9.4 J9.3 | R2.2 76.01,26.41 U$2.6 | U3.6 35.68,34.76 35.68,34.39 34.78,33.48 34.78,32.96 U3.16 | v28.61,32.71 28.61,36.21 C1.2
  Bottom 0.3: J7.20 v38.57,98.6 | v61.43,98.6 J7.2 | J5.1 v86.4,38.57 v86.4,61.43 J5.19 | J8.19 v13.6,38.57 v13.6,61.43 J8.1 | J7.1 v61.43,86.4 v38.57,86.4 J7.19 | J5.20 v98.6,61.43 | v98.6,38.57 J5.2 | J8.2 v1.4,61.43 | J8.20 v1.4,38.57 | v41.11,1.4 J9.4 | J9.2 v38.57,1.4 | J9.3 v41.11,13.6 | v38.57,13.6 J9.1 | J6.GND 23.6,24.51 26.83,27.73 26.99,27.73 29.61,30.35 29.61,30.92 29.66,30.97 C2.2 v28.61,32.71
  other vias: 30.88,96.2 69.14,96.2 96.2,69.14 96.2,30.88 30.88,3.8 3.8,30.88 69.14,3.8 3.8,69.14
  pour Top (isolate 1): 0,70.69 29.3,100 70.7,100 100,70.7 100,29.3 70.7,0 29.3,0 0,29.3
  pour Bottom (isolate 1): 99.99,70.66 70.69,99.97 29.29,99.97 -0.01,70.67 -0.01,29.27 29.29,-0.03 70.69,-0.03 99.99,29.27
GPIO0  (via drill 0.5)
  Top 0.3: RN9.1 27.22,55.7 22.79,60.13 8.21,60.12 6.97,58.88 J8.4 v1.4,58.89
  Bottom 0.3: v1.4,58.89 J8.4
GPIO1  (via drill 0.5)
  Top 0.3: RN9.2 26.64,54.9 22.65,58.89 J8.3 v8.55,58.89
  Bottom 0.3: J8.3 v8.55,58.89
GPIO2  (via drill 0.5)
  Top 0.3: RN9.3 26.17,54.1 22.6,57.67 8.29,57.66 6.98,56.34 J8.6 v1.4,56.35
  Bottom 0.3: J8.6 v1.4,56.35
GPIO3  (via drill 0.5)
  Top 0.3: RN9.4 25.52,53.3 22.47,56.35 J8.5 v8.55,56.35
  Bottom 0.3: v8.55,56.35 J8.5
GPIO4  (via drill 0.5)
  Top 0.3: RN10.1 25,52.2 22.12,55.08 8.29,55.09 7.02,53.82 J8.8 v1.4,53.81
  Bottom 0.3: v1.4,53.81 J8.8
GPIO5  (via drill 0.5)
  Top 0.3: RN10.2 24.51,51.4 22.1,53.81 J8.7 v8.55,53.81
  Bottom 0.3: J8.7 v8.55,53.81
GPIO6  (via drill 0.5)
  Top 0.3: RN10.3 23.84,50.6 21.92,52.53 8.37,52.52 7.12,51.26 J8.10 v1.4,51.27
  Bottom 0.3: J8.10 v1.4,51.27
GPIO7  (via drill 0.5)
  Top 0.3: RN10.4 23.22,49.8 21.75,51.27 J8.9 v8.55,51.27
  Bottom 0.3: v8.55,51.27 J8.9
I2C_SCL0  (via drill 0.5)
  Top 0.3: RN3.1 56.2,67.3 60.15,71.24 60.15,92.28 58.89,93.54 J7.4 v58.89,98.6
  Bottom 0.3: J7.4 v58.89,98.6
I2C_SCL1  (via drill 0.5)
  Top 0.3: RN3.3 54.6,69.07 57.55,72.01 57.55,91.93 56.35,93.13 J7.6 v56.35,98.6
  Bottom 0.3: v56.35,98.6 J7.6
I2C_SCL2  (via drill 0.5)
  Top 0.3: RN4.1 52.7,70.18 55.07,72.55 55.07,92.21 53.81,93.47 J7.8 v53.81,98.6
  Bottom 0.3: J7.8 v53.81,98.6
I2C_SCL3  (via drill 0.5)
  Top 0.3: RN4.3 51.1,71.34 52.56,72.8 52.56,92.24 51.27,93.53 J7.10 v51.27,98.6
  Bottom 0.3: v51.27,98.6 J7.10
I2C_SDA0  (via drill 0.5)
  Top 0.3: RN3.2 55.4,68.16 58.89,71.65 J7.3 v58.9,91.46
  Bottom 0.3: v58.9,91.46 J7.3
I2C_SDA1  (via drill 0.5)
  Top 0.3: RN3.4 53.8,69.87 56.35,72.42 J7.5 v56.35,91.46
  Bottom 0.3: J7.5 v56.35,91.46
I2C_SDA2  (via drill 0.5)
  Top 0.3: RN4.2 51.9,70.76 53.81,72.67 J7.7 v53.81,91.46
  Bottom 0.3: v53.81,91.46 J7.7
I2C_SDA3  (via drill 0.5)
  Top 0.3: RN4.4 50.3,71.98 51.27,72.95 J7.9 v51.27,91.46
  Bottom 0.3: J7.9 v51.27,91.46
LED1
  Top 0.3: LED1.A 31.55,27.15 R7.2
LED2
  Top 0.3: LED2.A R8.2
N$7
  Top 0.3: S1.5 71.19,28.76 73.68,28.76 R2.1
N$8  (via drill 0.3)
  Top 0.3: S1.6 69.19,24.26 v69.67,24.26 | v71.52,26.11 R3.1
  Bottom 0.3: v69.67,24.26 v71.52,26.11
N$10
  Top 0.3: R4.2 79.03,25.73 79.03,24.95 U$2.7
P0
  Top 0.3: U1.3 58.7,45 59.9,43.8 RN1.8
P1
  Top 0.3: U1.4 59.08,45.5 59.98,44.6 RN1.7
P2
  Top 0.3: U1.6 59.24,46.5 60.34,45.4 RN1.6
P3
  Top 0.3: U1.7 59.61,47 60.41,46.2 RN1.5
P4
  Top 0.3: U1.9 59.65,48 60.35,47.3 RN2.8
P5
  Top 0.3: U1.10 59.89,48.5 60.29,48.1 RN2.7
P6
  Top 0.3: U1.12 59.82,49.5 60.42,48.9 RN2.6
P7
  Top 0.3: U1.13 60.21,50 60.51,49.7 RN2.5
P8
  Top 0.3: U1.15 58.83,51 59.03,50.8 RN7.8
P9
  Top 0.3: U1.16 58.78,51.5 58.88,51.6 RN7.7
P10
  Top 0.3: U1.18 58.84,52.5 58.94,52.4 RN7.6
P11
  Top 0.3: U1.19 58.82,53 59.02,53.2 RN7.5
P12
  Top 0.3: U1.21 59.61,54 59.91,54.3 RN8.8
P13
  Top 0.3: U1.22 59.28,54.5 59.88,55.1 RN8.7
P14
  Top 0.3: U1.24 59.38,55.5 59.78,55.9 RN8.6
P15
  Top 0.3: U1.25 58.96,56 59.66,56.7 RN8.5
P16
  Top 0.3: U1.27 55.5,59.25 56.2,59.95 RN3.8
P17
  Top 0.3: U1.28 55,59.85 55.4,60.25 RN3.7
P18
  Top 0.3: U1.30 54,59.75 54.6,60.35 RN3.6
P19
  Top 0.3: U1.31 53.5,60.21 53.8,60.51 RN3.5
P20
  Top 0.3: U1.33 52.5,60.13 52.7,60.33 RN4.8
P21
  Top 0.3: U1.34 52,60.15 51.9,60.25 RN4.7
P22
  Top 0.3: U1.36 51,59.99 51.1,60.09 RN4.6
P23
  Top 0.3: U1.37 50.5,60 50.3,60.2 RN4.5
P24
  Top 0.3: U1.39 49.5,60.38 49.2,60.68 RN5.8
P25
  Top 0.3: U1.40 49,60.11 48.4,60.71 RN5.7
P26
  Top 0.3: U1.42 48,60.16 47.6,60.56 RN5.6
P27
  Top 0.3: U1.43 47.5,59.88 46.8,60.58 RN5.5
P28
  Top 0.3: U1.45 46.5,59.82 45.7,60.62 RN6.8
P29
  Top 0.3: U1.46 46,59.45 44.9,60.55 RN6.7
P30
  Top 0.3: U1.48 45,59.27 44.1,60.17 RN6.6
P31
  Top 0.3: U1.49 44.5,58.99 43.3,60.19 RN6.5
P32
  Top 0.3: U1.53 41.09,55 40.39,55.7 RN9.8
P33
  Top 0.3: U1.54 40.73,54.5 40.33,54.9 RN9.7
P34
  Top 0.3: U1.56 40.56,53.5 39.96,54.1 RN9.6
P35
  Top 0.3: U1.57 40.2,53 39.9,53.3 RN9.5
P36
  Top 0.3: U1.59 40.96,52 40.76,52.2 RN10.8
P37
  Top 0.3: U1.60 40.93,51.5 40.83,51.4 RN10.7
P38
  Top 0.3: U1.62 40.91,50.5 40.81,50.6 RN10.6
P39
  Top 0.3: U1.63 40.91,50 40.71,49.8 RN10.5
P40
  Top 0.3: U1.65 39.77,49 39.47,48.7 RN13.8
P41
  Top 0.3: U1.66 40.15,48.5 39.55,47.9 RN13.7
P42
  Top 0.3: U1.68 40.22,47.5 39.82,47.1 RN13.6
P43
  Top 0.3: U1.69 40.59,47 39.89,46.3 RN13.5
P44
  Top 0.3: U1.71 40.51,46 39.71,45.2 RN14.8
P45
  Top 0.3: U1.72 40.9,45.5 39.8,44.4 RN14.7
P46
  Top 0.3: U1.74 40.8,44.5 39.9,43.6 RN14.6
P47
  Top 0.3: U1.75 41.24,44 40.04,42.8 RN14.5
P62  (via drill 0.3, 0.5)
  Top 0.3: v42.26,37.26 R11.1 41.5,36.59 C3.1 | U1.98 55,40.75 v54.63,40.37
  Bottom 0.3: v54.63,40.37 45.37,40.37 v42.26,37.26
P63  (via drill 0.3)
  Top 0.3: U1.99 55.5,39.83 v55.91,39.42
  Bottom 0.3: C4.1 R12.1 46.96,39.42 v55.91,39.42
PWM0  (via drill 0.5)
  Top 0.3: RN13.1 22.59,48.7 21.32,49.97 8.35,49.97 7.11,48.73 J8.12 v1.4,48.73
  Bottom 0.3: v1.4,48.73 J8.12
PWM1  (via drill 0.5)
  Top 0.3: RN13.2 21.96,47.9 21.13,48.73 J8.11 v8.55,48.73
  Bottom 0.3: J8.11 v8.55,48.73
PWM2  (via drill 0.5)
  Top 0.3: RN13.3 21.24,47.1 20.89,47.46 8.32,47.46 7.05,46.19 J8.14 1.28,46.19 v1.4,46.2
  Bottom 0.3: v1.4,46.2 J8.14
PWM3  (via drill 0.5)
  Top 0.3: RN13.4 21.2,46.3 21.09,46.19 J8.13 v8.55,46.19
  Bottom 0.3: v8.55,46.19 J8.13
PWM4  (via drill 0.5)
  Top 0.3: RN14.1 21.28,45.2 21.01,44.93 8.28,44.93 7,43.65 J8.16 v1.4,43.65
  Bottom 0.3: J8.16 v1.4,43.65
PWM5  (via drill 0.5)
  Top 0.3: RN14.2 21.61,44.4 20.86,43.65 J8.15 v8.55,43.65
  Bottom 0.3: J8.15 v8.55,43.65
PWM6  (via drill 0.5)
  Top 0.3: RN14.3 22.17,43.6 20.94,42.38 8.29,42.38 7.03,41.12 J8.18 v1.4,41.11
  Bottom 0.3: v1.4,41.11 J8.18
PWM7  (via drill 0.5)
  Top 0.3: RN14.4 22.75,42.8 21.06,41.11 J8.17 v8.55,41.11
  Bottom 0.3: v8.55,41.11 J8.17
RESET_N  (via drill 0.3, 0.5)
  Top 0.3: v54.61,31.66 S1.1 | U1.100 56,40.72 v57.29,39.43
  Bottom 0.3: v57.29,39.43 54.61,36.75 v54.61,31.66
SD_CLK  (via drill 0.5)
  Top 0.3: U$2.5 v76.91,23.96 v76.91,23.97 | v69.9,19.96 S1.7 64.81,25.04 64.81,30.44 60.47,34.78 60.47,36.25 58.7,38.02 55.68,38.02 54,39.7 U1.96
  Bottom 0.3: v76.91,23.97 72.89,19.96 v69.9,19.96
SPI_MISO0  (via drill 0.5)
  Top 0.3: RN1.3 69.6,45.4 72.6,42.4 92.46,42.4 93.71,43.65 J5.6 v98.6,43.65
  Bottom 0.3: v98.6,43.65 J5.6
SPI_MISO1  (via drill 0.5)
  Top 0.3: RN2.3 70.87,48.9 72.26,47.52 92.3,47.52 93.52,48.73 J5.10 v98.6,48.73
  Bottom 0.3: v98.6,48.73 J5.10
SPI_MISO2  (via drill 0.5)
  Top 0.3: RN7.3 71.75,52.4 71.92,52.57 91.89,52.57 93.13,53.81 J5.14 v98.6,53.81
  Bottom 0.3: v98.6,53.81 J5.14
SPI_MISO3  (via drill 0.5)
  Top 0.3: RN8.3 70.17,55.9 71.91,57.64 91.64,57.64 92.89,58.89 J5.18 v98.6,58.89
  Bottom 0.3: J5.18 v98.6,58.89
SPI_MOSI0  (via drill 0.5)
  Top 0.3: RN1.2 69.33,44.6 72.82,41.11 J5.3 v91.46,41.11
  Bottom 0.3: v91.46,41.11 J5.3
SPI_MOSI1  (via drill 0.5)
  Top 0.3: RN2.2 70.44,48.1 72.35,46.19 J5.7 v91.46,46.19
  Bottom 0.3: v91.46,46.19 J5.7
SPI_MOSI2  (via drill 0.5)
  Top 0.3: RN7.2 71.74,51.6 72.07,51.27 J5.11 v91.46,51.27
  Bottom 0.3: v91.46,51.27 J5.11
SPI_MOSI3  (via drill 0.5)
  Top 0.3: RN8.2 70.66,55.1 71.91,56.35 J5.15 v91.46,56.35
  Bottom 0.3: v91.46,56.35 J5.15
SPI_SCLK0  (via drill 0.5)
  Top 0.3: RN1.1 69.02,43.8 72.98,39.84 92.2,39.84 93.47,41.11 J5.4 v98.6,41.11
  Bottom 0.3: J5.4 v98.6,41.11
SPI_SCLK1  (via drill 0.5)
  Top 0.3: RN2.1 69.98,47.3 72.35,44.94 92.52,44.94 93.77,46.19 J5.8 v98.6,46.19
  Bottom 0.3: J5.8 v98.6,46.19
SPI_SCLK2  (via drill 0.5)
  Top 0.3: RN7.1 71.56,50.8 72.28,50.08 92.12,50.08 93.31,51.27 J5.12 v98.6,51.26
  Bottom 0.3: J5.12 v98.6,51.26
SPI_SCLK3  (via drill 0.5)
  Top 0.3: RN8.1 71.22,54.3 72.02,55.1 91.62,55.1 92.87,56.35 J5.16 v98.6,56.35
  Bottom 0.3: v98.6,56.35 J5.16
SPI_SS0  (via drill 0.5)
  Top 0.3: RN1.4 69.91,46.2 72.46,43.65 J5.5 v91.46,43.65
  Bottom 0.3: J5.5 v91.46,43.65
SPI_SS1  (via drill 0.5)
  Top 0.3: RN2.4 71.32,49.7 72.29,48.73 J5.9 v91.46,48.73
  Bottom 0.3: J5.9 v91.46,48.73
SPI_SS2  (via drill 0.5)
  Top 0.3: RN7.4 71.45,53.2 72.06,53.81 J5.13 v91.46,53.81
  Bottom 0.3: J5.13 v91.46,53.81
SPI_SS3  (via drill 0.5)
  Top 0.3: RN8.4 69.67,56.7 71.86,58.89 J5.17 v91.46,58.89
  Bottom 0.3: J5.17 v91.46,58.89
U_1V8  (via drill 0.3, 0.5)
  Top 0.3: U1.52 v43.45,55.5 | v43.45,52.5 U1.58 | v43.45,46.5 U1.70 | U1.64 v43.45,49.5 43.48,49.5 | v47,56.55 U1.44 | U1.38 v50,56.55 | U1.32 v53,56.55 | U1.26 v56,56.55 | U1.76 v44,43.45 | v47.01,43.45 U1.82 47,18.19 46.19,17.38 v46.19,13.6 J9.7 | U1.88 v50,43.45 | U1.94 v53,43.45 | U1.2 v56.55,44.5 | U1.8 v56.55,47.5 | U1.14 v56.55,50.5 | U1.20 v56.55,53.5 | J9.8 J9.7 | J9.5 J9.7 | J9.6 J9.5 | J9.6 J9.8 | v43.65,13.6 J9.5 | J9.6 v43.65,1.4 | v46.19,1.4 J9.8
  Bottom 0.3: J9.5 v43.65,13.6 | v43.65,1.4 J9.6 | J9.8 v46.19,1.4 | J9.7 v46.19,13.6 | v43.45,52.5 v43.45,49.5 v43.45,46.5 43.45,44 v44,43.45 v47.01,43.45 v50,43.45 v53,43.45 55.52,43.45 v56.55,44.5 v56.55,47.5 v56.55,50.5 v56.55,53.5 56.55,56 v56,56.55 53.48,56.55 v53,56.55 v50,56.55 v47,56.55 44.5,56.55 v43.45,55.5 v43.45,52.5
U_3V3  (via drill 0.3, 0.5)  (2 unrouted)
  Top 0.3: U1.67 44.24,48 | U1.73 44.24,45 | U1.85 48.5,44.24 | U1.97 54.5,44.24 51.55,44.24 | U1.55 44.24,54 | 44.24,51 U1.61 | 44.24,51 44.24,48 | 44.24,54 44.24,51 | 44.24,45 44.24,48 | 44.24,45 44.24,44.24 45.5,44.24 | 45.5,44.24 48.5,44.24 | 48.5,44.24 51.5,44.24 U1.91 51.5,17.85 51.27,17.62 v51.27,13.6 J9.11 | 44.24,54 44.24,55.76 45.49,55.76 | 45.49,55.76 48.5,55.76 | 48.5,55.76 U1.41 | U1.47 45.49,55.76 | U1.35 51.5,55.76 | 51.5,55.76 48.5,55.76 | U1.29 54.5,55.76 | 54.5,55.76 51.5,55.76 | 54.5,55.76 55.76,55.76 55.76,55 | 55.76,55 55.76,52 | 55.76,52 U1.17 | U1.23 55.76,55 | U1.11 55.76,49 | 55.76,49 55.76,52 | U1.5 55.76,46 55.76,49 | J9.12 J9.11 | J9.9 J9.11 | J9.10 J9.9 | J9.10 J9.12 | J9.10 v48.73,1.4 | v51.27,1.4 J9.12 | J9.9 v48.73,13.6 | R3.2 U$2.4 78.13,21.11 v79.47,19.78 | v83.4,23.22 83.4,23.64 U2.3 71.7,35.34 69.9,35.34 U2.7 U2.8 v65.31,38.14 | 45.5,44.24 U1.79 45.5,41.28 44.92,40.7 38.8,40.7 R10.1 36.7,38.68 v36.06,38.04 | R1.2 v57.69,33.91 v57.69,33.92
  Bottom 0.3: v48.73,1.4 J9.10 | J9.12 v51.27,1.4 | v48.73,13.6 J9.9 | v51.27,13.6 J9.11 | v83.4,23.22 79.96,19.78 v79.47,19.78 | v57.69,33.92 61.91,38.14 v65.31,38.14 | R9.1 32.95,34.24 32.95,34.92 36.06,38.03 v36.06,38.04
U_5V  (via drill 0.5)
  Top 0.3: J9.13 J9.15 | J9.15 J9.16 | J9.14 J9.13 | J9.14 J9.16 | J9.14 v53.81,1.4 | v56.36,1.4 J9.16 | J9.15 56.36,13.4 v56.36,13.6 | v53.81,13.6 J9.13
  Bottom 0.3: v53.81,1.4 J9.14 | J9.16 56.35,1.38 v56.36,1.4 | v56.36,13.6 J9.15 | J9.13 v53.81,13.6
U_IN  (via drill 0.5)
  Top 0.3: J9.18 J9.20 | J9.18 v58.89,1.4 | v61.44,1.4 J9.20 | J9.20 J9.19 | J9.17 J9.18 | J9.17 J9.19 | J9.19 v61.43,13.6 | v58.9,13.6 J9.17
  Bottom 0.3: v58.89,1.4 J9.18 | J9.20 61.43,1.45 v61.44,1.4 | v61.43,13.6 J9.19 | J9.17 58.9,13.13 v58.9,13.6
UART_RX0  (via drill 0.5)
  Top 0.3: RN5.1 49.2,72.27 50.02,73.09 50.02,91.95 48.73,93.24 J7.12 v48.73,98.6
  Bottom 0.3: J7.12 v48.73,98.6
UART_RX1  (via drill 0.5)
  Top 0.3: RN5.3 47.6,73.14 47.5,73.24 47.5,91.86 46.19,93.16 J7.14 v46.19,98.6
  Bottom 0.3: v46.19,98.6 J7.14
UART_RX2  (via drill 0.5)
  Top 0.3: RN6.1 45.7,72.07 44.97,72.8 44.97,91.65 43.65,92.97 J7.16 v43.65,98.6
  Bottom 0.3: J7.16 v43.65,98.6
UART_RX3  (via drill 0.5)
  Top 0.3: RN6.3 44.1,70.89 42.41,72.58 42.41,91.72 41.11,93.01 J7.18 v41.12,98.6
  Bottom 0.3: v41.12,98.6 J7.18
UART_TX0  (via drill 0.5)
  Top 0.3: RN5.2 48.4,73.14 48.73,73.47 J7.11 v48.73,91.46
  Bottom 0.3: v48.73,91.46 J7.11
UART_TX1  (via drill 0.5)
  Top 0.3: RN5.4 46.8,72.53 46.19,73.14 J7.13 v46.2,91.46
  Bottom 0.3: J7.13 v46.2,91.46
UART_TX2  (via drill 0.5)
  Top 0.3: RN6.2 44.9,71.31 43.65,72.56 J7.15 v43.65,91.46
  Bottom 0.3: v43.65,91.46 J7.15
UART_TX3  (via drill 0.5)
  Top 0.3: RN6.4 43.3,70.38 41.11,72.57 J7.17 v41.12,91.46
  Bottom 0.3: J7.17 v41.12,91.46
USB_3V3  (via drill 0.3)
  Top 0.3: C1.1 v34.76,34.74 U3.14 U3.13 | v36.08,33.43 37.04,33.43 U3.3
  Bottom 0.3: v34.76,34.74 v36.08,33.43
USB_5V  (2 unrouted)
  Top 0.3: R7.1 28.01,25.97 R8.1 27.64,26.39 27.64,27.35 31.5,31.21 32.12,31.21 U3.15
USB_RX
  Top 0.3: U3.4 39.03,36.32 C3.2 | R10.2 39.09,36.38 C3.2 | C3.2 40.1,35.3 R11.2
USB_TX  (1 unrouted)
  Bottom 0.3: R12.2 37.26,30 C4.2 36.25,30.93 R9.2
USBDM  (via drill 0.3)
  Top 0.3: U3.12 27.46,29.24 v27.46,29.13
  Bottom 0.3: v27.46,29.13 26.69,28.36 R5.1
USBDP  (via drill 0.3)
  Top 0.3: U3.11 25.66,28.34 v19.31,28.34
  Bottom 0.3: v19.31,28.34 R6.1
VBUS
  Bottom 0.3: L1.1 25.02,24.11 J6.VBUS
XIN
  Top 0.3: Y1.P$2 41.38,56 U1.51
XOUT
  Top 0.3: Y1.P$1 44,58.62 U1.50